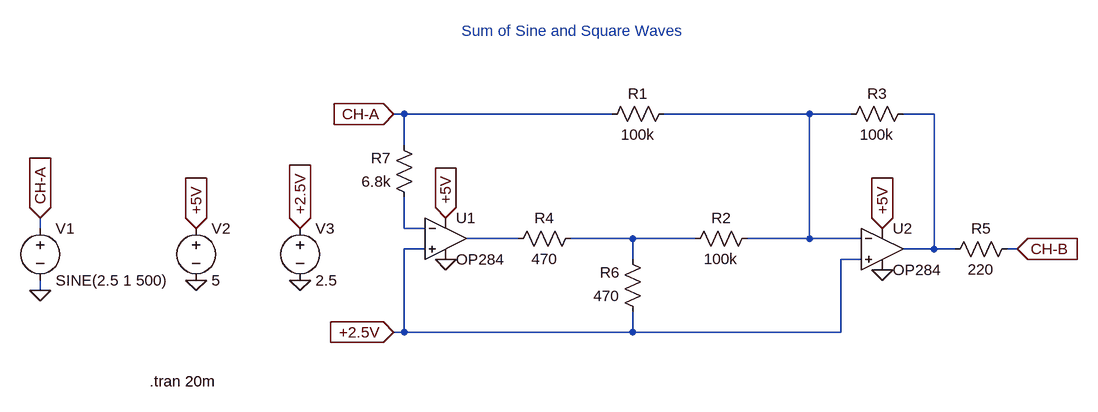
[diagram p0: schematic sum_of_sine_and_square_waves_ltspice.asc]
sum_of_sine_and_square_waves_ltspice.asc, the LTspice schematic file:
Version 4
SHEET 1 920 884
WIRE -144 256 -160 256
WIRE 176 256 -144 256
WIRE 480 256 256 256
WIRE 544 256 480 256
WIRE 672 256 624 256
WIRE -144 304 -144 256
WIRE -704 432 -704 416
WIRE -144 432 -144 384
WIRE -112 432 -144 432
WIRE 32 448 -48 448
WIRE 208 448 112 448
WIRE 304 448 208 448
WIRE 480 448 480 256
WIRE 480 448 384 448
WIRE 560 448 480 448
WIRE -112 464 -144 464
WIRE 672 464 672 256
WIRE 672 464 624 464
WIRE 704 464 672 464
WIRE 800 464 784 464
WIRE 208 480 208 448
WIRE 560 480 528 480
WIRE -704 528 -704 512
WIRE -144 592 -144 464
WIRE -144 592 -160 592
WIRE 208 592 208 560
WIRE 208 592 -144 592
WIRE 528 592 528 480
WIRE 528 592 208 592
FLAG -160 256 CH-A
IOPIN -160 256 In
FLAG -160 592 +2.5V
IOPIN -160 592 In
FLAG 592 432 +5V
IOPIN 592 432 In
FLAG 800 464 CH-B
IOPIN 800 464 In
FLAG -80 480 0
FLAG 592 496 0
FLAG -464 512 0
FLAG -304 512 0
FLAG -464 432 +5V
IOPIN -464 432 In
FLAG -304 432 +2.5V
IOPIN -304 432 In
FLAG -80 416 +5V
IOPIN -80 416 In
FLAG -704 528 0
FLAG -704 416 CH-A
IOPIN -704 416 In
SYMBOL Opamps\\OP284 -80 384 R0
SYMATTR InstName U1
SYMBOL Opamps\\OP284 592 400 R0
SYMATTR InstName U2
SYMBOL res 272 240 R90
WINDOW 0 0 56 VBottom 2
WINDOW 3 32 56 VTop 2
SYMATTR InstName R1
SYMATTR Value 100k
SYMBOL res 400 432 R90
WINDOW 0 0 56 VBottom 2
WINDOW 3 32 56 VTop 2
SYMATTR InstName R2
SYMATTR Value 100k
SYMBOL res 640 240 R90
WINDOW 0 0 56 VBottom 2
WINDOW 3 32 56 VTop 2
SYMATTR InstName R3
SYMATTR Value 100k
SYMBOL res 128 432 R90
WINDOW 0 0 56 VBottom 2
WINDOW 3 32 56 VTop 2
SYMATTR InstName R4
SYMATTR Value 470
SYMBOL res 800 448 R90
WINDOW 0 0 56 VBottom 2
WINDOW 3 32 56 VTop 2
SYMATTR InstName R5
SYMATTR Value 220
SYMBOL res 224 576 R180
WINDOW 0 36 76 Left 2
WINDOW 3 36 40 Left 2
SYMATTR InstName R6
SYMATTR Value 470
SYMBOL res -128 400 R180
WINDOW 0 36 76 Left 2
WINDOW 3 36 40 Left 2
SYMATTR InstName R7
SYMATTR Value 6.8k
SYMBOL voltage -464 416 R0
SYMATTR InstName V2
SYMATTR Value 5
SYMBOL voltage -304 416 R0
SYMATTR InstName V3
SYMATTR Value 2.5
SYMBOL voltage -704 416 R0
WINDOW 123 0 0 Left 0
WINDOW 39 0 0 Left 0
SYMATTR InstName V1
SYMATTR Value SINE(2.5 1 500)
TEXT -56 128 Left 2 ;Sum of Sine and Square Waves
TEXT -536 668 Left 2 !.tran 20m

The netlist it stands for:
* sum_of_sine_and_square_waves_ltspice.asc
XU1 +2.5V N003 +5V 0 N004 OP284  ; pins In+ In- V+ V- OUT
XU2 +2.5V N001 +5V 0 N002 OP284  ; pins In+ In- V+ V- OUT
R1 N001 CH-A 100k
R2 N001 N005 100k
R3 N002 N001 100k
R4 N005 N004 470
R5 CH-B N002 220
R6 +2.5V N005 470
R7 N003 CH-A 6.8k
V2 +5V 0 5
V3 +2.5V 0 2.5
V1 CH-A 0 SINE(2.5 1 500)
* Sum of Sine and Square Waves
.tran 20m
.lib ADI1.lib
.backanno
.end